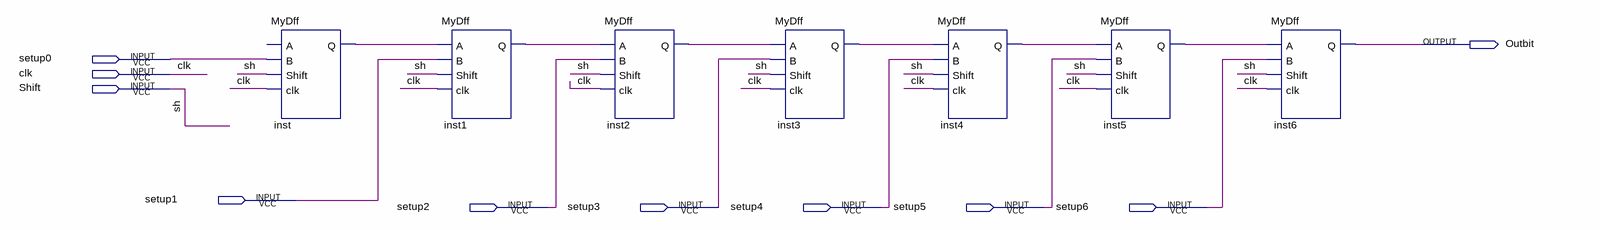
[diagram p0: schematic sheet]
// Quartus schematic setup.bdf as structural Verilog: 7 symbols, 10 pins
module setup (
  input  setup0,
  input  clk,
  input  Shift,
  input  setup1,
  input  setup2,
  input  setup3,
  input  setup4,
  input  setup5,
  input  setup6,
  output Outbit
);

  wire inst1_q, inst2_q, inst3_q, inst4_q, inst5_q, inst_q;

  MyDff inst (.B(setup0), .Shift(Shift), .clk(clk), .Q(inst_q));  // open: A
  MyDff inst1 (.A(inst_q), .B(setup1), .Shift(Shift), .clk(clk), .Q(inst1_q));
  MyDff inst2 (.A(inst1_q), .B(setup2), .Shift(Shift), .clk(clk), .Q(inst2_q));
  MyDff inst3 (.A(inst2_q), .B(setup3), .Shift(Shift), .clk(clk), .Q(inst3_q));
  MyDff inst4 (.A(inst3_q), .B(setup4), .Shift(Shift), .clk(clk), .Q(inst4_q));
  MyDff inst5 (.A(inst4_q), .B(setup5), .Shift(Shift), .clk(clk), .Q(inst5_q));
  MyDff inst6 (.A(inst5_q), .B(setup6), .Shift(Shift), .clk(clk), .Q(Outbit));

  // Other names for the same wires on the sheet: sh = Shift
endmodule
